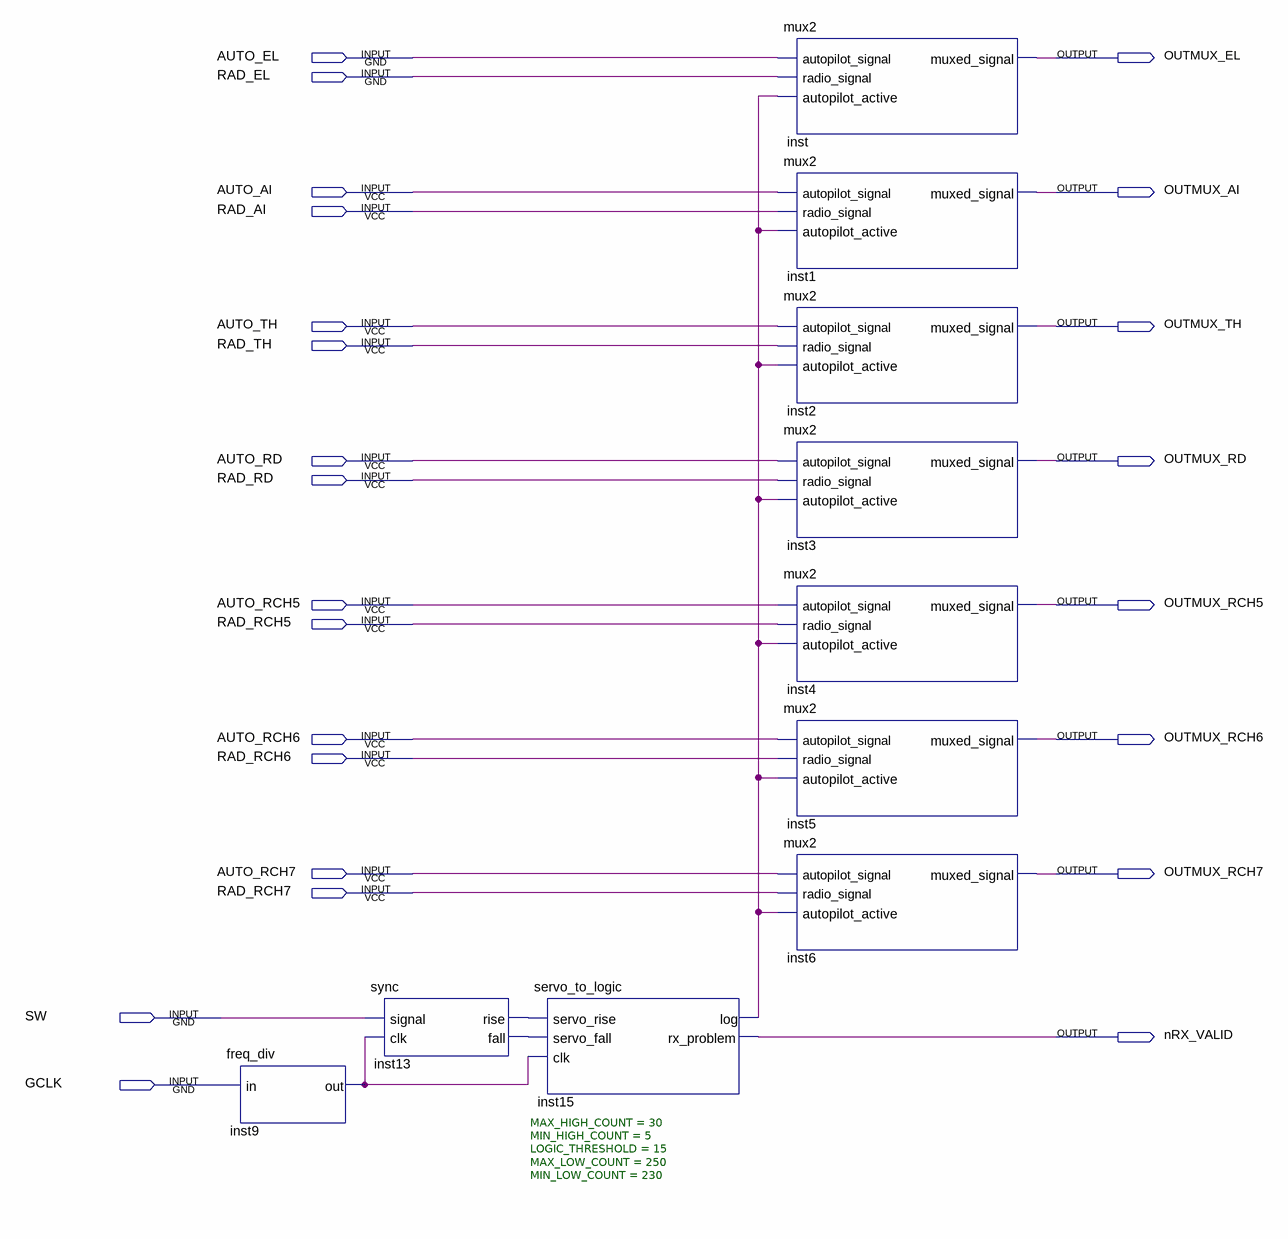
[diagram p0: schematic sheet]
// Quartus schematic autopilot_mux_cpld.bdf as structural Verilog: 10 symbols, 24 pins
module autopilot_mux_cpld (
  input  AUTO_EL,
  input  RAD_EL,
  input  AUTO_AI,
  input  RAD_AI,
  input  AUTO_TH,
  input  RAD_TH,
  input  AUTO_RD,
  input  RAD_RD,
  input  AUTO_RCH5,
  input  RAD_RCH5,
  input  AUTO_RCH6,
  input  RAD_RCH6,
  input  AUTO_RCH7,
  input  RAD_RCH7,
  input  SW,
  input  GCLK,
  output OUTMUX_EL,
  output OUTMUX_AI,
  output OUTMUX_TH,
  output OUTMUX_RD,
  output OUTMUX_RCH5,
  output OUTMUX_RCH6,
  output OUTMUX_RCH7,
  output nRX_VALID
);

  wire inst9_out, inst13_fall, inst13_rise, inst15_log;

  freq_div inst9 (.in(GCLK), .out(inst9_out));
  sync inst13 (.signal(SW), .clk(inst9_out), .rise(inst13_rise), .fall(inst13_fall));
  servo_to_logic #(.MAX_HIGH_COUNT(30), .MIN_HIGH_COUNT(5), .LOGIC_THRESHOLD(15), .MAX_LOW_COUNT(250), .MIN_LOW_COUNT(230)) inst15 (
    .servo_rise(inst13_rise), .servo_fall(inst13_fall), .clk(inst9_out), .log(inst15_log),
    .rx_problem(nRX_VALID));
  mux2 inst (
    .autopilot_signal(AUTO_EL), .radio_signal(RAD_EL), .autopilot_active(inst15_log), .muxed_signal(OUTMUX_EL));
  mux2 inst1 (
    .autopilot_signal(AUTO_AI), .radio_signal(RAD_AI), .autopilot_active(inst15_log), .muxed_signal(OUTMUX_AI));
  mux2 inst2 (
    .autopilot_signal(AUTO_TH), .radio_signal(RAD_TH), .autopilot_active(inst15_log), .muxed_signal(OUTMUX_TH));
  mux2 inst3 (
    .autopilot_signal(AUTO_RD), .radio_signal(RAD_RD), .autopilot_active(inst15_log), .muxed_signal(OUTMUX_RD));
  mux2 inst4 (
    .autopilot_signal(AUTO_RCH5), .radio_signal(RAD_RCH5), .autopilot_active(inst15_log),
    .muxed_signal(OUTMUX_RCH5));
  mux2 inst5 (
    .autopilot_signal(AUTO_RCH6), .radio_signal(RAD_RCH6), .autopilot_active(inst15_log),
    .muxed_signal(OUTMUX_RCH6));
  mux2 inst6 (
    .autopilot_signal(AUTO_RCH7), .radio_signal(RAD_RCH7), .autopilot_active(inst15_log),
    .muxed_signal(OUTMUX_RCH7));
endmodule
